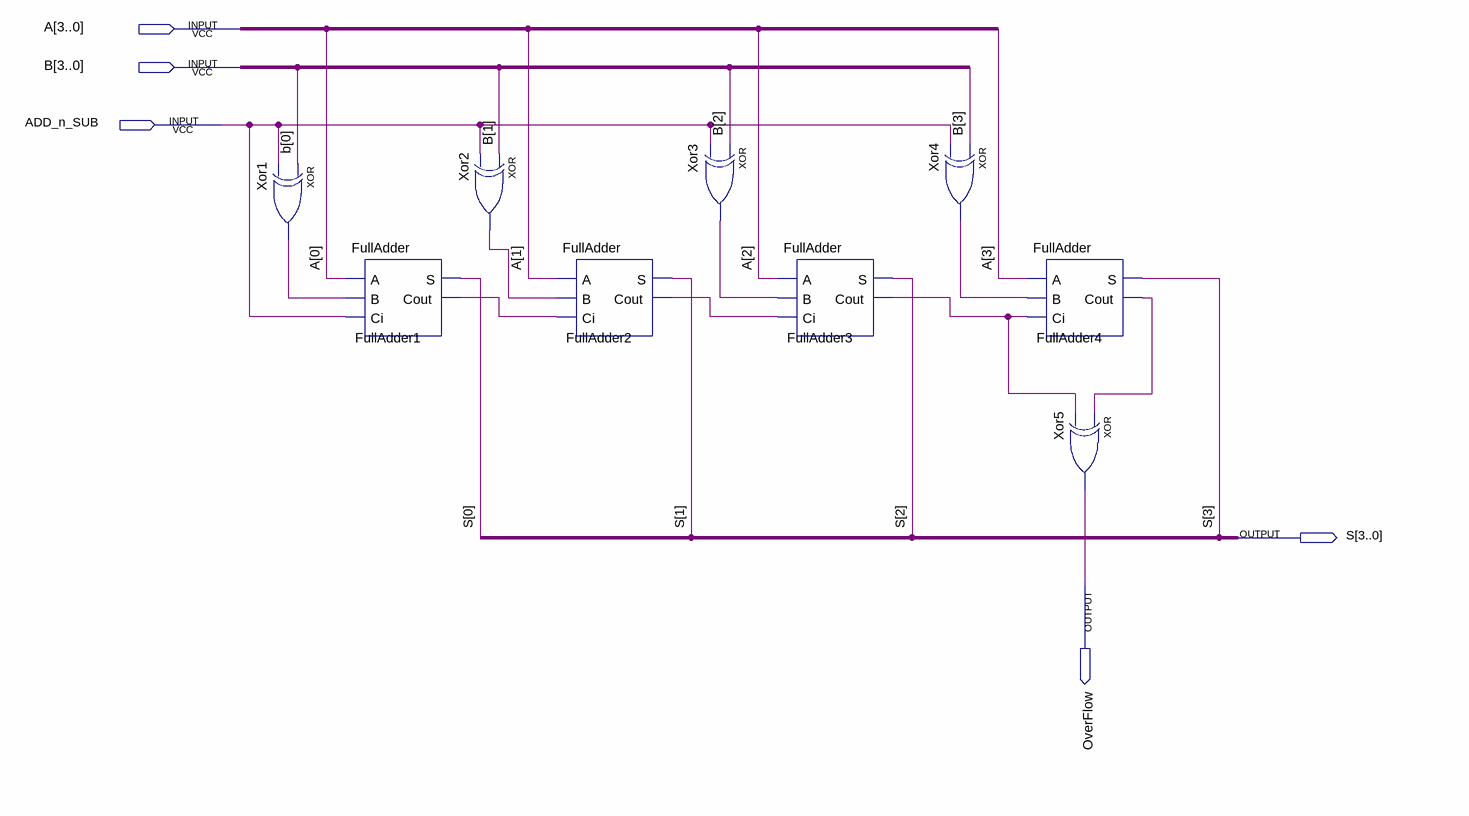
[diagram p0: schematic sheet]
// Quartus schematic AddSub4.bdf as structural Verilog: 9 symbols, 5 pins
module AddSub4 (
  input  [3:0] A,
  input  [3:0] B,
  input  ADD_n_SUB,
  output [3:0] S,
  output OverFlow
);

  wire FullAdder1_cout, FullAdder2_cout, FullAdder3_cout, FullAdder4_cout, Xor1_out, Xor2_out, Xor3_out,
       Xor4_out;

  xor Xor1 (Xor1_out, B[0], ADD_n_SUB);
  FullAdder FullAdder1 (.A(A[0]), .B(Xor1_out), .Ci(ADD_n_SUB), .S(S[0]), .Cout(FullAdder1_cout));
  xor Xor2 (Xor2_out, B[1], ADD_n_SUB);
  FullAdder FullAdder2 (.A(A[1]), .B(Xor2_out), .Ci(FullAdder1_cout), .S(S[1]), .Cout(FullAdder2_cout));
  xor Xor3 (Xor3_out, B[2], ADD_n_SUB);
  FullAdder FullAdder3 (.A(A[2]), .B(Xor3_out), .Ci(FullAdder2_cout), .S(S[2]), .Cout(FullAdder3_cout));
  xor Xor4 (Xor4_out, B[3], ADD_n_SUB);
  FullAdder FullAdder4 (.A(A[3]), .B(Xor4_out), .Ci(FullAdder3_cout), .S(S[3]), .Cout(FullAdder4_cout));
  xor Xor5 (OverFlow, FullAdder4_cout, FullAdder3_cout);
endmodule
